# EAGLE schematic BMS Layout (EAGLE 7.6.0)
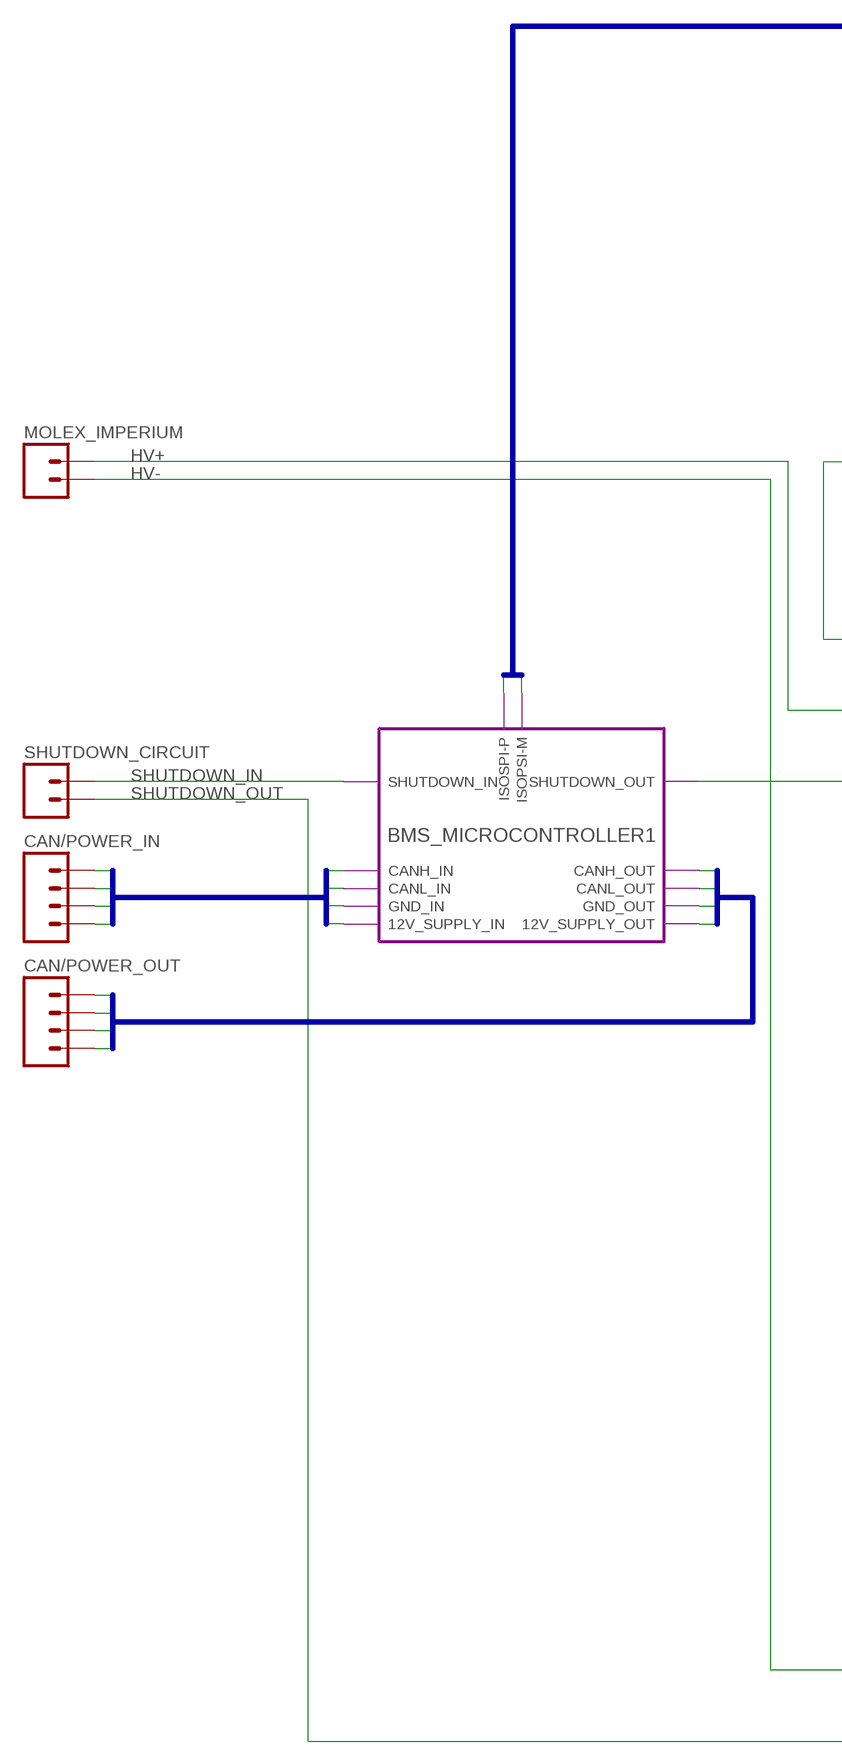
[diagram p0: schematic, sheet 1, part 1 of 2]
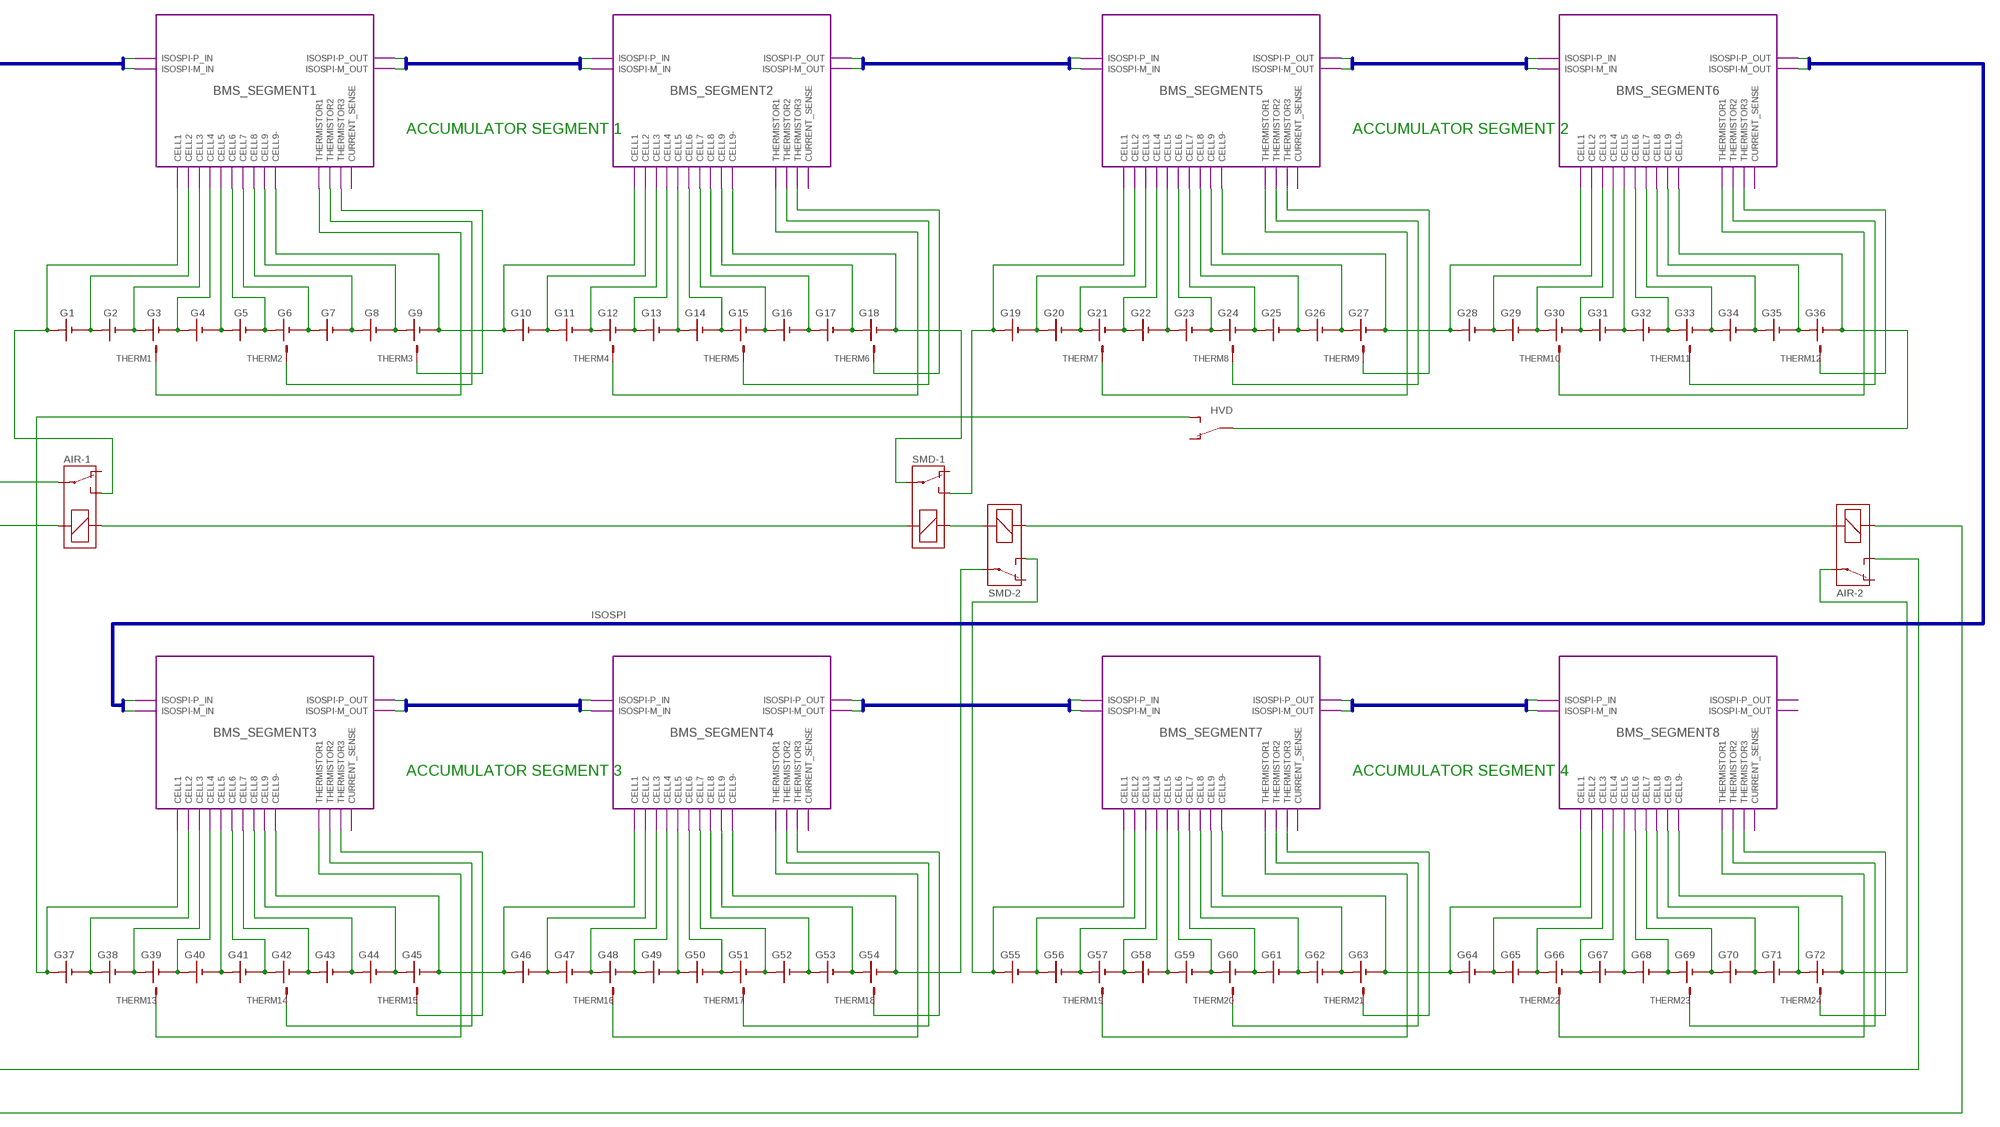
[diagram p1: schematic, sheet 1, part 2 of 2]

## Parts
AIR-1  RELAY  (no package)
AIR-2  RELAY  (no package)
CAN/POWER_IN  M04  (no package)
CAN/POWER_OUT  M04  (no package)
G1  BATTERY_1_CELL  (no package)
G2  BATTERY_1_CELL  (no package)
G3  BATTERY_1_CELL  (no package)
G4  BATTERY_1_CELL  (no package)
G5  BATTERY_1_CELL  (no package)
G6  BATTERY_1_CELL  (no package)
G7  BATTERY_1_CELL  (no package)
G8  BATTERY_1_CELL  (no package)
G9  BATTERY_1_CELL  (no package)
G10  BATTERY_1_CELL  (no package)
G11  BATTERY_1_CELL  (no package)
G12  BATTERY_1_CELL  (no package)
G13  BATTERY_1_CELL  (no package)
G14  BATTERY_1_CELL  (no package)
G15  BATTERY_1_CELL  (no package)
G16  BATTERY_1_CELL  (no package)
G17  BATTERY_1_CELL  (no package)
G18  BATTERY_1_CELL  (no package)
G19  BATTERY_1_CELL  (no package)
G20  BATTERY_1_CELL  (no package)
G21  BATTERY_1_CELL  (no package)
G22  BATTERY_1_CELL  (no package)
G23  BATTERY_1_CELL  (no package)
G24  BATTERY_1_CELL  (no package)
G25  BATTERY_1_CELL  (no package)
G26  BATTERY_1_CELL  (no package)
G27  BATTERY_1_CELL  (no package)
G28  BATTERY_1_CELL  (no package)
G29  BATTERY_1_CELL  (no package)
G30  BATTERY_1_CELL  (no package)
G31  BATTERY_1_CELL  (no package)
G32  BATTERY_1_CELL  (no package)
G33  BATTERY_1_CELL  (no package)
G34  BATTERY_1_CELL  (no package)
G35  BATTERY_1_CELL  (no package)
G36  BATTERY_1_CELL  (no package)
G37  BATTERY_1_CELL  (no package)
G38  BATTERY_1_CELL  (no package)
G39  BATTERY_1_CELL  (no package)
G40  BATTERY_1_CELL  (no package)
G41  BATTERY_1_CELL  (no package)
G42  BATTERY_1_CELL  (no package)
G43  BATTERY_1_CELL  (no package)
G44  BATTERY_1_CELL  (no package)
G45  BATTERY_1_CELL  (no package)
G46  BATTERY_1_CELL  (no package)
G47  BATTERY_1_CELL  (no package)
G48  BATTERY_1_CELL  (no package)
G49  BATTERY_1_CELL  (no package)
G50  BATTERY_1_CELL  (no package)
G51  BATTERY_1_CELL  (no package)
G52  BATTERY_1_CELL  (no package)
G53  BATTERY_1_CELL  (no package)
G54  BATTERY_1_CELL  (no package)
G55  BATTERY_1_CELL  (no package)
G56  BATTERY_1_CELL  (no package)
G57  BATTERY_1_CELL  (no package)
G58  BATTERY_1_CELL  (no package)
G59  BATTERY_1_CELL  (no package)
G60  BATTERY_1_CELL  (no package)
G61  BATTERY_1_CELL  (no package)
G62  BATTERY_1_CELL  (no package)
G63  BATTERY_1_CELL  (no package)
G64  BATTERY_1_CELL  (no package)
G65  BATTERY_1_CELL  (no package)
G66  BATTERY_1_CELL  (no package)
G67  BATTERY_1_CELL  (no package)
G68  BATTERY_1_CELL  (no package)
G69  BATTERY_1_CELL  (no package)
G70  BATTERY_1_CELL  (no package)
G71  BATTERY_1_CELL  (no package)
G72  BATTERY_1_CELL  (no package)
HVD  SWITCH_SPST  (no package)
MOLEX_IMPERIUM  M02  (no package)
SHUTDOWN_CIRCUIT  M02  (no package)
SMD-1  RELAY  (no package)
SMD-2  RELAY  (no package)
THERM1  THERMISTOR  (no package)
THERM2  THERMISTOR  (no package)
THERM3  THERMISTOR  (no package)
THERM4  THERMISTOR  (no package)
THERM5  THERMISTOR  (no package)
THERM6  THERMISTOR  (no package)
THERM7  THERMISTOR  (no package)
THERM8  THERMISTOR  (no package)
THERM9  THERMISTOR  (no package)
THERM10  THERMISTOR  (no package)
THERM11  THERMISTOR  (no package)
THERM12  THERMISTOR  (no package)
THERM13  THERMISTOR  (no package)
THERM14  THERMISTOR  (no package)
THERM15  THERMISTOR  (no package)
THERM16  THERMISTOR  (no package)
THERM17  THERMISTOR  (no package)
THERM18  THERMISTOR  (no package)
THERM19  THERMISTOR  (no package)
THERM20  THERMISTOR  (no package)
THERM21  THERMISTOR  (no package)
THERM22  THERMISTOR  (no package)
THERM23  THERMISTOR  (no package)
THERM24  THERMISTOR  (no package)

## Module instances
BMS_SEGMENT1 = BMS_SEGMENT
BMS_SEGMENT2 = BMS_SEGMENT
BMS_SEGMENT3 = BMS_SEGMENT
BMS_SEGMENT4 = BMS_SEGMENT
BMS_SEGMENT5 = BMS_SEGMENT
BMS_SEGMENT6 = BMS_SEGMENT
BMS_SEGMENT7 = BMS_SEGMENT
BMS_SEGMENT8 = BMS_SEGMENT
BMS_MICROCONTROLLER1 = BMS_MICROCONTROLLER

## Nets
B$1: port BMS_SEGMENT1.ISOSPI-P_OUT BMS_SEGMENT1.ISOSPI-M_OUT BMS_SEGMENT2.ISOSPI-P_OUT BMS_SEGMENT2.ISOSPI-M_OUT BMS_SEGMENT5.ISOSPI-P_OUT BMS_SEGMENT5.ISOSPI-M_OUT BMS_SEGMENT3.ISOSPI-P_OUT BMS_SEGMENT3.ISOSPI-M_OUT BMS_SEGMENT4.ISOSPI-P_OUT BMS_SEGMENT4.ISOSPI-M_OUT BMS_SEGMENT7.ISOSPI-P_OUT BMS_SEGMENT7.ISOSPI-M_OUT
B$2: port BMS_SEGMENT2.ISOSPI-P_IN BMS_SEGMENT2.ISOSPI-M_IN BMS_SEGMENT5.ISOSPI-P_IN BMS_SEGMENT5.ISOSPI-M_IN BMS_SEGMENT6.ISOSPI-P_IN BMS_SEGMENT6.ISOSPI-M_IN BMS_SEGMENT4.ISOSPI-P_IN BMS_SEGMENT4.ISOSPI-M_IN BMS_SEGMENT7.ISOSPI-P_IN BMS_SEGMENT7.ISOSPI-M_IN BMS_SEGMENT8.ISOSPI-P_IN BMS_SEGMENT8.ISOSPI-M_IN
B$3: port BMS_MICROCONTROLLER1.ISOSPI-P BMS_MICROCONTROLLER1.ISOPSI-M
B$4: port BMS_SEGMENT1.ISOSPI-P_IN BMS_SEGMENT1.ISOSPI-M_IN
B$5: port BMS_SEGMENT6.ISOSPI-P_OUT BMS_SEGMENT6.ISOSPI-M_OUT BMS_SEGMENT3.ISOSPI-P_IN BMS_SEGMENT3.ISOSPI-M_IN BMS_MICROCONTROLLER1.CANH_IN BMS_MICROCONTROLLER1.CANL_IN BMS_MICROCONTROLLER1.GND_IN BMS_MICROCONTROLLER1.12V_SUPPLY_IN
B$6: port BMS_MICROCONTROLLER1.CANH_OUT BMS_MICROCONTROLLER1.CANL_OUT BMS_MICROCONTROLLER1.GND_OUT BMS_MICROCONTROLLER1.12V_SUPPLY_OUT
B$7: CAN/POWER_IN.1 CAN/POWER_IN.2 CAN/POWER_IN.3 CAN/POWER_IN.4
B$8: CAN/POWER_OUT.1 CAN/POWER_OUT.2 CAN/POWER_OUT.3 CAN/POWER_OUT.4
HV+: AIR-1.P MOLEX_IMPERIUM.2
HV-: AIR-2.S MOLEX_IMPERIUM.1
N$7: AIR-1.1 SMD-1.2
N$8: SMD-1.1 SMD-2.2
N$15: AIR-1.S G1.+ ; port BMS_SEGMENT1.CELL1
N$16: G10.- G11.+ ; port BMS_SEGMENT2.CELL2
N$17: G11.- G12.+ ; port BMS_SEGMENT2.CELL3
N$18: G12.- G13.+ ; port BMS_SEGMENT2.CELL4
N$19: G1.- G2.+ ; port BMS_SEGMENT1.CELL2
N$20: G13.- G14.+ ; port BMS_SEGMENT2.CELL5
N$21: G2.- G3.+ ; port BMS_SEGMENT1.CELL3
N$22: G14.- G15.+ ; port BMS_SEGMENT2.CELL6
N$23: G15.- G16.+ ; port BMS_SEGMENT2.CELL7
N$24: G16.- G17.+ ; port BMS_SEGMENT2.CELL8
N$25: G17.- G18.+ ; port BMS_SEGMENT2.CELL9
N$26: G3.- G4.+ ; port BMS_SEGMENT1.CELL4
N$27: G18.- SMD-1.P ; port BMS_SEGMENT2.CELL9-
N$28: G28.- G29.+ ; port BMS_SEGMENT6.CELL2
N$29: G19.- G20.+ ; port BMS_SEGMENT5.CELL2
N$30: G20.- G21.+ ; port BMS_SEGMENT5.CELL3
N$31: G21.- G22.+ ; port BMS_SEGMENT5.CELL4
N$32: G22.- G23.+ ; port BMS_SEGMENT5.CELL5
N$33: G4.- G5.+ ; port BMS_SEGMENT1.CELL5
N$34: G23.- G24.+ ; port BMS_SEGMENT5.CELL6
N$35: G24.- G25.+ ; port BMS_SEGMENT5.CELL7
N$36: G25.- G26.+ ; port BMS_SEGMENT5.CELL8
N$37: G5.- G6.+ ; port BMS_SEGMENT1.CELL6
N$38: G26.- G27.+ ; port BMS_SEGMENT5.CELL9
N$39: G27.- G28.+ ; port BMS_SEGMENT5.CELL9- BMS_SEGMENT6.CELL1
N$40: G19.+ SMD-1.S ; port BMS_SEGMENT5.CELL1
N$41: G6.- G7.+ ; port BMS_SEGMENT1.CELL7
N$42: G29.- G30.+ ; port BMS_SEGMENT6.CELL3
N$43: G30.- G31.+ ; port BMS_SEGMENT6.CELL4
N$44: G7.- G8.+ ; port BMS_SEGMENT1.CELL8
N$45: G31.- G32.+ ; port BMS_SEGMENT6.CELL5
N$46: G32.- G33.+ ; port BMS_SEGMENT6.CELL6
N$47: G8.- G9.+ ; port BMS_SEGMENT1.CELL9
N$48: G33.- G34.+ ; port BMS_SEGMENT6.CELL7
N$49: G34.- G35.+ ; port BMS_SEGMENT6.CELL8
N$50: G35.- G36.+ ; port BMS_SEGMENT6.CELL9
N$51: G37.+ HVD.S ; port BMS_SEGMENT3.CELL1
N$53: G37.- G38.+ ; port BMS_SEGMENT3.CELL2
N$54: G9.- G10.+ ; port BMS_SEGMENT1.CELL9- BMS_SEGMENT2.CELL1
N$55: G38.- G39.+ ; port BMS_SEGMENT3.CELL3
N$56: G39.- G40.+ ; port BMS_SEGMENT3.CELL4
N$57: G40.- G41.+ ; port BMS_SEGMENT3.CELL5
N$58: G41.- G42.+ ; port BMS_SEGMENT3.CELL6
N$59: G42.- G43.+ ; port BMS_SEGMENT3.CELL7
N$60: G43.- G44.+ ; port BMS_SEGMENT3.CELL8
N$61: G44.- G45.+ ; port BMS_SEGMENT3.CELL9
N$62: G45.- G46.+ ; port BMS_SEGMENT3.CELL9- BMS_SEGMENT4.CELL1
N$64: G46.- G47.+ ; port BMS_SEGMENT4.CELL2
N$65: G47.- G48.+ ; port BMS_SEGMENT4.CELL3
N$66: G48.- G49.+ ; port BMS_SEGMENT4.CELL4
N$67: G49.- G50.+ ; port BMS_SEGMENT4.CELL5
N$68: G50.- G51.+ ; port BMS_SEGMENT4.CELL6
N$69: G51.- G52.+ ; port BMS_SEGMENT4.CELL7
N$70: G52.- G53.+ ; port BMS_SEGMENT4.CELL8
N$71: G53.- G54.+ ; port BMS_SEGMENT4.CELL9
N$72: G54.- SMD-2.P ; port BMS_SEGMENT4.CELL9-
N$73: THERM1.S ; port BMS_SEGMENT1.THERMISTOR1
N$74: G55.- G56.+ ; port BMS_SEGMENT7.CELL2
N$75: G56.- G57.+ ; port BMS_SEGMENT7.CELL3
N$76: G57.- G58.+ ; port BMS_SEGMENT7.CELL4
N$77: G58.- G59.+ ; port BMS_SEGMENT7.CELL5
N$78: G59.- G60.+ ; port BMS_SEGMENT7.CELL6
N$79: G60.- G61.+ ; port BMS_SEGMENT7.CELL7
N$80: G61.- G62.+ ; port BMS_SEGMENT7.CELL8
N$81: G62.- G63.+ ; port BMS_SEGMENT7.CELL9
N$82: G63.- G64.+ ; port BMS_SEGMENT7.CELL9- BMS_SEGMENT8.CELL1
N$83: G55.+ SMD-2.S ; port BMS_SEGMENT7.CELL1
N$84: G64.- G65.+ ; port BMS_SEGMENT8.CELL2
N$85: G65.- G66.+ ; port BMS_SEGMENT8.CELL3
N$86: G66.- G67.+ ; port BMS_SEGMENT8.CELL4
N$87: G67.- G68.+ ; port BMS_SEGMENT8.CELL5
N$88: G68.- G69.+ ; port BMS_SEGMENT8.CELL6
N$89: G69.- G70.+ ; port BMS_SEGMENT8.CELL7
N$90: G70.- G71.+ ; port BMS_SEGMENT8.CELL8
N$91: G71.- G72.+ ; port BMS_SEGMENT8.CELL9
N$92: AIR-2.P G72.- ; port BMS_SEGMENT8.CELL9-
N$93: THERM2.S ; port BMS_SEGMENT1.THERMISTOR2
N$94: G36.- HVD.P ; port BMS_SEGMENT6.CELL9-
N$95: THERM3.S ; port BMS_SEGMENT1.THERMISTOR3
N$96: THERM4.S ; port BMS_SEGMENT2.THERMISTOR1
N$97: THERM5.S ; port BMS_SEGMENT2.THERMISTOR2
N$98: THERM6.S ; port BMS_SEGMENT2.THERMISTOR3
N$99: THERM7.S ; port BMS_SEGMENT5.THERMISTOR1
N$100: THERM8.S ; port BMS_SEGMENT5.THERMISTOR2
N$101: THERM9.S ; port BMS_SEGMENT5.THERMISTOR3
N$102: THERM10.S ; port BMS_SEGMENT6.THERMISTOR1
N$103: THERM11.S ; port BMS_SEGMENT6.THERMISTOR2
N$104: THERM12.S ; port BMS_SEGMENT6.THERMISTOR3
N$105: THERM13.S ; port BMS_SEGMENT3.THERMISTOR1
N$106: THERM14.S ; port BMS_SEGMENT3.THERMISTOR2
N$107: THERM15.S ; port BMS_SEGMENT3.THERMISTOR3
N$108: THERM16.S ; port BMS_SEGMENT4.THERMISTOR1
N$109: THERM17.S ; port BMS_SEGMENT4.THERMISTOR2
N$110: THERM18.S ; port BMS_SEGMENT4.THERMISTOR3
N$111: THERM19.S ; port BMS_SEGMENT7.THERMISTOR1
N$112: THERM20.S ; port BMS_SEGMENT7.THERMISTOR2
N$113: THERM21.S ; port BMS_SEGMENT7.THERMISTOR3
N$114: THERM22.S ; port BMS_SEGMENT8.THERMISTOR1
N$115: THERM23.S ; port BMS_SEGMENT8.THERMISTOR2
N$116: THERM24.S ; port BMS_SEGMENT8.THERMISTOR3
N$117: AIR-2.2 SMD-2.1
N$120: AIR-1.2 ; port BMS_MICROCONTROLLER1.SHUTDOWN_OUT
SHUTDOWN_IN: SHUTDOWN_CIRCUIT.2 ; port BMS_MICROCONTROLLER1.SHUTDOWN_IN
SHUTDOWN_OUT: AIR-2.1 SHUTDOWN_CIRCUIT.1
Unconnected: AIR-1.O AIR-2.O HVD.O SMD-1.O SMD-2.O

## Buses
B$1
B$2
B$3
B$4
ISOSPI
B$5
B$6
B$7
B$8

## Notes on the sheet
- ACCUMULATOR SEGMENT 1 | ACCUMULATOR SEGMENT 2
- ACCUMULATOR SEGMENT 3 | ACCUMULATOR SEGMENT 4

## Library data of the parts
AIR-1 AIR-2 SMD-1 SMD-2 = HyTechSymbols:RELAY: RELAY 1 x switch
CAN/POWER_IN CAN/POWER_OUT = HyTechSymbols:M04: Generic 4-pin connector
G1-G72 = HyTechSymbols:BATTERY_1_CELL: Generic 1-cell battery Source: Sonnenschein
HVD = HyTechSymbols:SWITCH_SPST: Single Pull Single Throw Switch
MOLEX_IMPERIUM SHUTDOWN_CIRCUIT = HyTechSymbols:M02: Generic 2-pin connector
THERM1-THERM24 = HyTechSymbols:THERMISTOR

## Module BMS_SEGMENT
Ports: CELL1(in) CELL2(in) CELL3(in) CELL4(in) CELL5(in) CELL6(in) CELL7(in) CELL8(in) CELL9(in) ISOSPI-P_IN(in) ISOSPI-M_IN(in) ISOSPI-P_OUT(out) ISOSPI-M_OUT(out) THERMISTOR1(in) THERMISTOR2(in) THERMISTOR3(in) CURRENT_SENSE(in) CELL9-(in)

### Library data of the parts

## Module BMS_MICROCONTROLLER
Ports: ISOSPI-P(out) ISOPSI-M(out) 12V_SUPPLY_IN(in) GND_IN(in) CANL_IN(in) CANH_IN(in) 12V_SUPPLY_OUT(out) GND_OUT(out) CANL_OUT(out) CANH_OUT(out) SHUTDOWN_IN(in) SHUTDOWN_OUT(out)

### Library data of the parts